# Altium schematic sheet 11_DAC.SchDoc
size 420 x 297 mm; SheetNumber: 11; SheetTotal: 12
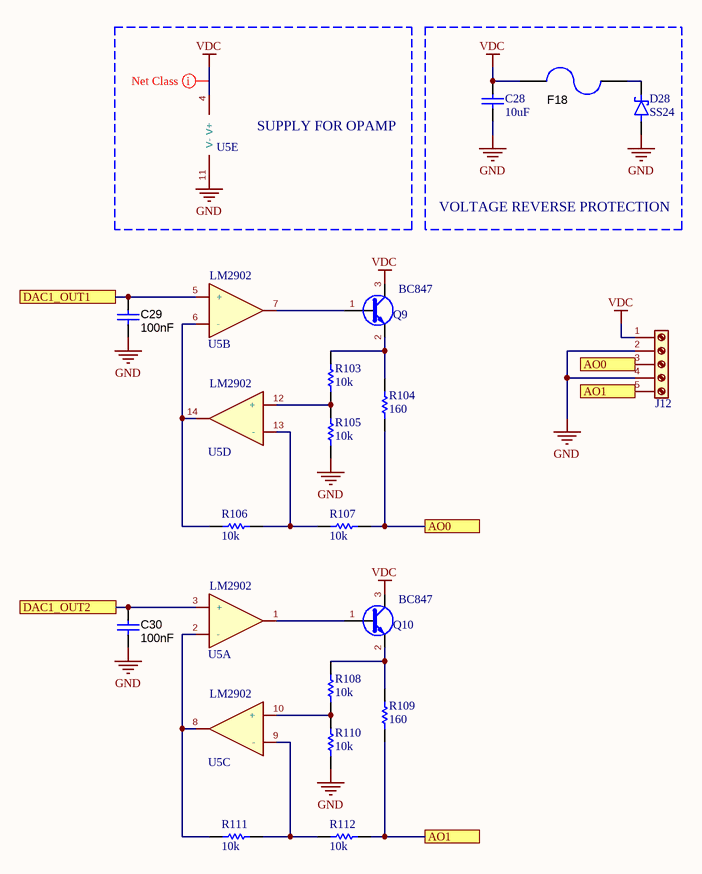
[diagram p0: 11_DAC.SchDoc]

## Parts
C28  ValueDisplayed: 10uF  [C_1206_3216Metric]  (hidden comment: CGA6P1X7R1E106M250AC)
C29  ValueDisplayed: 100nF  [0603]  (hidden comment: CAP 100nF 0603)
C30  ValueDisplayed: 100nF  [0603]  (hidden comment: CAP 100nF 0603)
D28  SS24  [DIOM5336X265N]
F18  0440005.WR  [CAPC4520X203N]  (value not drawn)
J12  Terminal_01x5_P5.00  [TerminalBlock_Phoenix_PT-1,5-5-5.0-H_1x5_P5.00mm_Horizontal]  (value not drawn)
Q9  BC847  [SOT-23]
Q10  BC847  [SOT-23]
R103  ValueDisplayed: 10k  [0603]  (hidden comment: RES 10K 0603)
R104  ValueDisplayed: 160  [0603]  (hidden comment: CRCW060320R0JNEA)
R105  ValueDisplayed: 10k  [0603]  (hidden comment: RES 10K 0603)
R106  ValueDisplayed: 10k  [0603]  (hidden comment: RES 10K 0603)
R107  ValueDisplayed: 10k  [0603]  (hidden comment: RES 10K 0603)
R108  ValueDisplayed: 10k  [0603]  (hidden comment: RES 10K 0603)
R109  ValueDisplayed: 160  [0603]  (hidden comment: CRCW060320R0JNEA)
R110  ValueDisplayed: 10k  [0603]  (hidden comment: RES 10K 0603)
R111  ValueDisplayed: 10k  [0603]  (hidden comment: RES 10K 0603)
R112  ValueDisplayed: 10k  [0603]  (hidden comment: RES 10K 0603)
U5  LM2902  [SOIC-14_3.9x8.7mm_P1.27mm]  (parts A,B,C,D,E of 5)

## Blocks framed on the sheet
SUPPLY FOR OPAMP: U5
VOLTAGE REVERSE PROTECTION: C28 D28 F18

## Ports
AO0 (see 11_DAC[2A]), AO0 (see 11_DAC[2B]), AO1 (see 11_DAC[2B]), AO1 (see 11_DAC[2C]), DAC1_OUT1 (see 04_STM32F303VCT6[3B]), DAC1_OUT2 (see 04_STM32F303VCT6[3B])

## Nets
GND: C28.2 C29.2 C30.2 D28.A J12.2(Pin_2) J12.4(Pin_4) R105.1 R110.1 U5.11(V-)
VDC: C28.1 F18.2 J12.1(Pin_1) Q9.3(C) Q10.3(C) U5.4(V+)
AO0: J12.3(Pin_3) R104.1 R107.2 ; port AO0
AO1: J12.5(Pin_5) R109.1 R112.2 ; port AO1
DAC1_OUT1: C29.1 U5.5(+) ; port DAC1_OUT1
DAC1_OUT2: C30.1 U5.3(+) ; port DAC1_OUT2
NetD28_C: D28.C(K) F18.1
NetQ9_1: Q9.1(B) U5.7
NetQ9_2: Q9.2(E) R103.2 R104.2
NetQ10_1: Q10.1(B) U5.1
NetQ10_2: Q10.2(E) R108.2 R109.2
NetR103_1: R103.1 R105.2 U5.12(+)
NetR106_1: R106.1 U5.6(-) U5.14
NetR106_2: R106.2 R107.1 U5.13(-)
NetR108_1: R108.1 R110.2 U5.10(+)
NetR111_1: R111.1 U5.2(-) U5.8
NetR111_2: R111.2 R112.1 U5.9(-)

## Layout directives
net class PWR: VDC

## Notes on the sheet
- Sub-system:
- Project:
- Design by:
- Sheet title:
- Sheet
- of
- Checked by:
- Approved by:
- Doc No:
- Revision:
- Size:
- Date:
- A3

## Library data of the parts
C28 = CAP 10uF 1206: Manufacturer: TDK; TaMin_C: -55°C; Polarized: N; TempCo: X7R; SizeAreaWB_mm2: 14.7; Value1: Unknown; U/M: EA; Value: 10uF; TaMax_C: 125°C; Tolerance_%: 20%; SizeZ_mm: 2.8; SizeX_mm: 3.2; SizeY_mm: 2.5; Cap_Case: 1210; Value2: 25V; SizeArea_mm2: 8; CompType: Capacitor; AEC Qualified: Y; Cap_F: 10µF; AEC Grade: 1; AEC Category: Q200; Supplier Part Number 2: 810-CGA6P1X7R1E106M; Publisher: Texas Instruments; Supplier 2: Mouser; Published: 2008-06-19; RoHS: Y; MountType: SMT; Supplier 1: Digi-Key; PackageReference: 1210; LatestRevisionDate: 2017-03-09; PartNumber: CGA6P1X7R1E106M250AC; VDC_V: 25V; ComponentLink1Description: Datasheet link; Supplier Part Number 1: 445-5720-1-ND; Technology: Ceramic; ComponentLink1URL: http://product.tdk.com/en/catalog/datasheets/mlcc_automotive_general_en.pdf
C29 C30 = CAP 100nF 0603: CAP, CERM, 100 nF, 25 V, +/- 10%, X7R, AEC-Q200 Grade 1, 0603; Manufacturer: MuRata; PartNumber: GCM188R70J225KE22D; TaMin_C: -55°C; Polarized: N; SizeAreaWB_mm2: 4.68; Value1: Unknown; U/M: EA; Value: 2.2uF; TaMax_C: 125°C; SizeZ_mm: 1; SizeX_mm: 1.6; SizeY_mm: 0.8; Value2: 6.3V; SizeArea_mm2: 1.28; CompType: Capacitor; AEC Qualified: Y; Cap_F: 2.2µF; AEC Category: Q200; Supplier Part Number 2: 81-GCM188R70J225KE2D; Publisher: Texas Instruments; Supplier 2: Mouser; TempCo: X7R; Published: 2008-06-19; RoHS: Y; MountType: SMT; Supplier 1: Digi-Key; PackageReference: 0603; Tolerance_%: 10%; Cap_Case: 0603; LatestRevisionDate: 2017-03-09; VDC_V: 6.3V; ComponentLink1Description: Datasheet link; AEC Grade: 1; Supplier Part Number 1: 490-5316-1-ND; Technology: Ceramic; ComponentLink1URL: http://psearch.en.murata.com/capacitor/product/GCM188R70J225KE22%23.pdf
D28 = SS24: Diode Schottky 40V 2A Surface Mount DO-214AA (SMB); MF: ON Semiconductor; Package: DO-214AA ON Semiconductor; Price: None; Value: *; SnapEDA_Link: https://www.snapeda.com/parts/SS24/Onsemi/view-part/?ref=snap; MP: SS24; Availability: In Stock; Check_prices: https://www.snapeda.com/parts/SS24/Onsemi/view-part/?ref=eda
F18 = FUSE 1808: Fuse, 5 A, 32VAC/VDC, SMD; Manufacturer: Littelfuse; Irating_A: 5A; SizeAreaWB_mm2: 10.92; Interrupt_AC: 50A; VAC_V: 32V; SizeZ_mm: 1.35; SizeX_mm: 3.2; SizeY_mm: 1.6; SizeArea_mm2: 5.12; Rtyp_Ohm: 0.012; MeltingTyp: 4.761; ComponentLink1URL: http://www.littelfuse.com/~/media/electronics/datasheets/fuses/littelfuse_fuse_440_datasheet.pdf.pdf; Supplier Part Number 2: 64R8013; Supplier 2: Newark; Supplier Part Number 3: 576-0440005.WR; Supplier 3: Mouser; RoHS: Y; MountType: SMT; Interrupt_DC: 50A; Supplier 1: Digi-Key; PackageReference: 1206; CompType: Fuse; PartNumber: 0440005.WR; VDC_V: 32V; ComponentLink1Description: Datasheet URL; Supplier Part Number 1: F1608CT-ND
R103 R105-R108 R110-R112 = RES 10K 0603 1%: RES, 10K, 1%, 0.1 W, AEC-Q200 Grade 0, 0603; Manufacturer: Vishay-Dale; PartNumber: CRCW060320R0JNEA; Power_W: 100mW; TempCo: 200 ppm/C; Value_Code: 20R0; Value1: 5%; Value: 20; EIA_Code: E24; SizeX_mm: 1.6; SizeY_mm: 0.8; SizeZ_mm: 1; Value2: 0.1W; SizeArea_mm2: 1.28; CompType: Resistor; AEC Qualified: Y; VDC_V: 75V; AEC Category: Q200; AEC Grade: 0; Supplier Part Number 2: 59M6784; Supplier 2: Newark; Supplier Part Number 3: 71-CRCW0603J-20-E3; Supplier 3: Mouser; RoHS: E; MountType: SMT; Supplier 1: Digi-Key; PackageReference: 0603; Tolerance_%: 5%; Res_ohm: 20; ComponentLink1Description: Datasheet link; Supplier Part Number 1: 541-20GCT-ND; Technology: Thick Film; ComponentLink1URL: http://www.vishay.com/docs/20035/dcrcwe3.pdf
R104 R109 = RES 160R 0603: RES, 160, 5%, 0.1 W, AEC-Q200 Grade 0, 0603; Manufacturer: Vishay-Dale; Power_W: 100mW; TempCo: 200 ppm/C; Value_Code: 20R0; Value: 20; EIA_Code: E24; SizeX_mm: 1.6; SizeY_mm: 0.8; SizeZ_mm: 1; Value2: 0.1W; SizeArea_mm2: 1.28; CompType: Resistor; AEC Qualified: Y; VDC_V: 75V; AEC Category: Q200; AEC Grade: 0; Supplier Part Number 2: 59M6784; Supplier 2: Newark; Supplier Part Number 3: 71-CRCW0603J-20-E3; Supplier 3: Mouser; RoHS: E; Value1: 5%; MountType: SMT; Supplier 1: Digi-Key; PackageReference: 0603; Tolerance_%: 5%; Res_ohm: 20; PartNumber: CRCW060320R0JNEA; ComponentLink1Description: Datasheet link; Supplier Part Number 1: 541-20GCT-ND; Technology: Thick Film; ComponentLink1URL: http://www.vishay.com/docs/20035/dcrcwe3.pdf